# Altium schematic sheet Audio.SchDoc
size A4; Organization: Altium Limited; Address1: L3, 12a Rodborough Rd; Address2: Frenchs Forest; Address3: NSW; Address4: Australia 2086
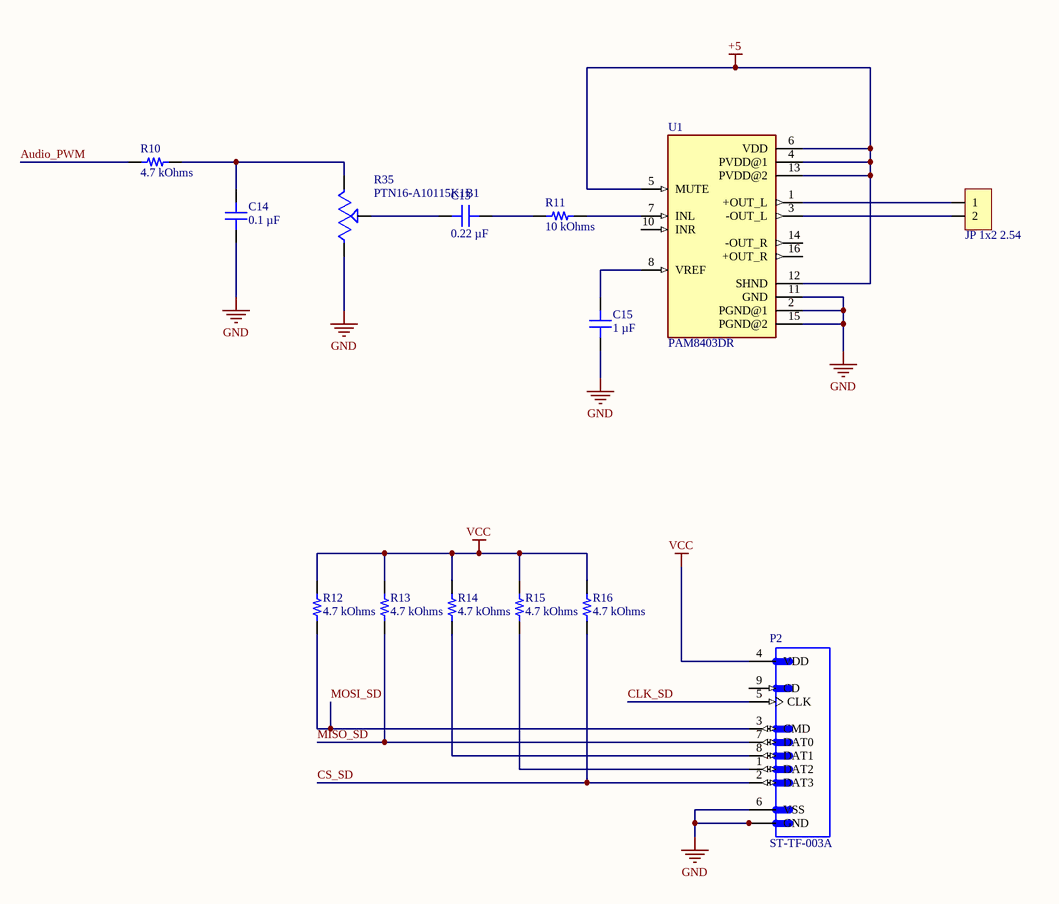
[diagram p0: Audio.SchDoc]

## Parts
C13  0.22 µF  [CAP 0603_1608]
C14  0.1 µF  [CAP 0603_1608]
C15  1 µF  [CAP 0603_1608]
JP5  JP 1x2 2.54  [JP 1x2 CT]
P2  ST-TF-003A  [SUNTECH_ST-TF-003A]
R10  4.7 kOhms  [RES 0603_1608]
R11  10 kOhms  [RES 0603_1608]
R12  4.7 kOhms  [RES 0603_1608]
R13  4.7 kOhms  [RES 0603_1608]
R14  4.7 kOhms  [RES 0603_1608]
R15  4.7 kOhms  [RES 0603_1608]
R16  4.7 kOhms  [RES 0603_1608]
R35  PTN16-A10115K1B1  [POT_PTN16-A10115K1B1]
U1  PAM8403DR  [SOIC127P605X150-16N]

## Nets
+5: U1.4(PVDD@1) U1.5(MUTE) U1.6(VDD) U1.12(SHND) U1.13(PVDD@2)
GND: C14.1 C15.1 P2.6(VSS) P2.G1(GND) P2.G2(GND) P2.G3(GND) P2.G4(GND) R35.1 U1.2(PGND@1) U1.11(GND) U1.15(PGND@2)
VCC: P2.4(VDD) R12.2 R13.2 R14.2 R15.2 R16.2
Audio_PWM: R10.1
CLK_SD: P2.5(CLK)
CS_SD: P2.2(DAT3) R16.1
MISO_SD: P2.7(DAT0) R13.1
MOSI_SD: P2.3(CMD) R12.1
NetC13_1: C13.1 R35.2
NetC13_2: C13.2 R11.1
NetC14_2: C14.2 R10.2 R35.3
NetC15_2: C15.2 U1.8(VREF)
NetJP5_1: JP5.1 U1.1(+OUT_L)
NetJP5_2: JP5.2 U1.3(-OUT_L)
NetP2_1: P2.1(DAT2) R15.1
NetP2_8: P2.8(DAT1) R14.1
NetR11_2: R11.2 U1.7(INL)

Not connected (* = marked no-connect by the designer): P2 9(CD); U1 10(INR) 14(-OUT_R) 16(+OUT_R)

## Notes on the sheet
- Title
- Size:
- Date:
- A4
- Number:
- Time:
- Revision:
- Sheet
- of
- File:

## Library data of the parts
C13 = KGM15BR71A224MT: CAP CER 0.22UF 10V X7R 0603; manufacturer: KYOCERA AVX; Tolerance: ±20%; Part Number: KGM15BR71A224MT; Value: 0.22 µF; Applications: General Purpose; Capacitance: 0.22 µF; componentlink1description: Datasheet; componentlink1url: https://datasheets.kyocera-avx.com/X7RDielectric.pdf; componentlink2description: DigiKey Link; componentlink2url: https://www.digikey.com/en/products/detail/kyocera-avx/KGM15BR71A224MT/1116255; Device Package: 0603 (1608 Metric); lastupdated: 2/9/2024 8:09:12 PM; Lifecycle Status: Active; Minimum Order: 1; Mounting Type: Surface Mount, MLCC; Operating Temperature: -55°C ~ 125°C; Package / Case: 0603 (1608 Metric); packaging: TapeAndReel; partid: 53200; Part Status: Active; price: 0.05; series: KGM - X7R; Size / Dimension: 0.063" L x 0.032" W (1.60mm x 0.81mm); Supplier 1: DigiKey; Supplier Part Number 1: 478-KGM15BR71A224MTCT-ND; Temperature Coefficient: X7R; Thickness (Max): 0.037" (0.95mm); Voltage - Rated: 10V
C14 = CX0603MRX7R6BB104: CAP CER 0.1UF 10V X7R 0603; manufacturer: PulseLarsen Antennas; Tolerance: ±20%; Part Number: CX0603MRX7R6BB104; Value: 0.1 µF; Applications: Bypass, Decoupling; Capacitance: 0.1 µF; componentlink1description: Datasheet; componentlink1url: https://productfinder.pulseelectronics.com/api/open/product-attachments/datasheet/cx0805mrx7r0bb102; componentlink2description: DigiKey Link; componentlink2url: https://www.digikey.com/en/products/detail/pulselarsen-antennas/CX0603MRX7R6BB104/1219074; Device Package: 0603 (1608 Metric); Features: Low ESL (X2Y); lastupdated: 2/9/2024 8:09:55 PM; Lifecycle Status: Active; Minimum Order: 1; Mounting Type: Surface Mount, MLCC; Operating Temperature: -55°C ~ 125°C; Package / Case: 0603 (1608 Metric); packaging: TapeAndReel; partid: 34696; Part Status: Active; price: 0.09; series: X2Y®; Size / Dimension: 0.063" L x 0.033" W (1.60mm x 0.85mm); Supplier 1: DigiKey; Supplier Part Number 1: 311-1237-1-ND; Temperature Coefficient: X7R; Thickness (Max): 0.030" (0.75mm); Voltage - Rated: 10V
C15 = CM105X7R105M10AT: CAP CER 1UF 10V X7R 0603; manufacturer: KYOCERA AVX; Tolerance: ±20%; Part Number: CM105X7R105M10AT; Value: 1 µF; Applications: General Purpose; Capacitance: 1 µF; componentlink1description: Datasheet; componentlink1url: https://ele.kyocera.com/assets/products/capacitor/CM_Series_e.pdf; componentlink2description: DigiKey Link; componentlink2url: https://www.digikey.com/en/products/detail/kyocera-avx/CM105X7R105M10AT/10815023; Device Package: 0603 (1608 Metric); lastupdated: 2/9/2024 8:09:58 PM; Lifecycle Status: Active; Minimum Order: 1; Mounting Type: Surface Mount, MLCC; Operating Temperature: -55°C ~ 125°C; Package / Case: 0603 (1608 Metric); packaging: TapeAndReel; partid: 35538; Part Status: Active; price: 0.02; series: CM; Size / Dimension: 0.063" L x 0.031" W (1.60mm x 0.80mm); Supplier 1: DigiKey; Supplier Part Number 1: 478-CM105X7R105M10ATCT-ND; Temperature Coefficient: X7R; Thickness (Max): 0.035" (0.90mm); Voltage - Rated: 10V
JP5 = JP 1x2 2.54 Cai Thang: Cắm; Ten_Linh_Kien: Jump Đơn Cái 2.54MM 1x20P Thẳng; Don_Vi: Con; Ma_Hang: MH004006; Ghi_Chu: *; Kieu_Chan: *; Chung_Loai: Cắm
P2 = ST-TF-003A: Micro SD Card Socket; Price: None; MP: ST-TF-003A; Availability: Unavailable; Value: *; Package: None
R10 = ERA-3ARB472V: RES SMD 4.7K OHM 0.1% 1/10W 0603; Manufacturer: Panasonic Electronic Components; Power (Watts): 0.1W, 1/10W; Temperature Coefficient: ±10ppm/°C; Part Number: ERA-3ARB472V; Value: 4.7 kOhms; ComponentLink1Description: Datasheet; ComponentLink1URL: https://industrial.panasonic.com/cdbs/www-data/pdf/RDM0000/AOA0000C307.pdf; ComponentLink2Description: DigiKey Link; ComponentLink2URL: https://www.digikey.com/en/products/detail/panasonic-electronic-components/ERA-3ARB472V/3073667; Composition: Thin Film; Device Package: 0603 (1608 Metric); Features: Automotive AEC-Q200; Height - Seated (Max): 0.022" (0.55mm); LastUpdated: 2/9/2024 8:42:34 PM; Lifecycle Status: Active; Minimum Order: 1; Number of Terminations: 2; Operating Temperature: -55°C ~ 155°C; Package / Case: 0603 (1608 Metric); Packaging: TapeAndReel; PartId: 20792; Part Status: Active; Price: 0.15; Ratings: AEC-Q200; Resistance: 4.7 kOhms; Series: ERA-3A; Size / Dimension: 0.063" L x 0.031" W (1.60mm x 0.80mm); Supplier 1: DigiKey; Supplier Part Number 1: P4.7KBDCT-ND; Supplier Device Package: 0603; Tolerance: ±0.1%
R11 = MCT06030E1002BP100: RES SMD 10K OHM 0.1% 1/10W 0603; Manufacturer: Vishay Beyschlag; Power (Watts): 0.1W, 1/10W; Temperature Coefficient: ±15ppm/°C; Part Number: MCT06030E1002BP100; Value: 10 kOhms; ComponentLink1Description: Datasheet; ComponentLink1URL: http://www.vishay.com/docs/28700/mcx0x0xpre.pdf; ComponentLink2Description: DigiKey Link; ComponentLink2URL: http://digikey.com/product-detail/en/vishay-beyschlag/MCT06030E1002BP100/749-1718-1-ND/7348026; Composition: Thin Film; Device Package: 0603 (1608 Metric); Features: Anti-Sulfur; Height - Seated (Max): 0.022" (0.55mm); LastUpdated: 2/9/2024 8:42:57 PM; Lifecycle Status: Active; Minimum Order: 1; Number of Terminations: 2; Operating Temperature: -55°C ~ 125°C; Package / Case: 0603 (1608 Metric); Packaging: TapeAndReel; PartId: 15019; Part Status: Active; Price: 0.26; Resistance: 10 kOhms; Series: MCT - Precision; Size / Dimension: 0.061" L x 0.033" W (1.55mm x 0.85mm); Supplier 1: DigiKey; Supplier Part Number 1: 749-1718-1-ND; Supplier Device Package: 0603; Tolerance: ±0.1%
R12-R16 = URG1608L-472-L-T05: RES SMD 4.7KOHM 0.01% 1/16W 0603; Manufacturer: Susumu; Power (Watts): 0.063W, 1/16W; Temperature Coefficient: ±2ppm/°C; Part Number: URG1608L-472-L-T05; Value: 4.7 kOhms; ComponentLink1Description: Datasheet; ComponentLink1URL: http://www.susumu.co.jp/common/pdf/n_catalog_partition03_en.pdf; ComponentLink2Description: DigiKey Link; ComponentLink2URL: https://www.digikey.com/en/products/detail/susumu/URG1608L-472-L-T05/4552652; Composition: Thin Film; Device Package: 0603 (1608 Metric); Features: Anti-Sulfur, Automotive AEC-Q200; Height - Seated (Max): 0.022" (0.55mm); LastUpdated: 2/9/2024 8:43:04 PM; Lifecycle Status: Active; Minimum Order: 1; Number of Terminations: 2; Operating Temperature: -55°C ~ 155°C; Package / Case: 0603 (1608 Metric); Packaging: TapeAndReel; PartId: 13142; Part Status: Active; Price: 4.24; Ratings: AEC-Q200; Resistance: 4.7 kOhms; Series: URG; Size / Dimension: 0.063" L x 0.031" W (1.60mm x 0.80mm); Supplier 1: DigiKey; Supplier Part Number 1: 408-1772-1-ND; Supplier Device Package: 0603; Tolerance: ±0.01%
R35 = PTN16-A10115K1B1: MF: {'manufacturer': u'CUI Devices'}; Package: None; Price: None; Value: *; MP: PTN16-A10115K1B1; Availability: Unavailable
U1 = PAM8403DR: Amplifier IC 2-Channel _Stereo_ Class D 16-SOP; MF: Diodes Inc.; MP: PAM8403DR; Availability: Unavailable; Package: SOP-16 Diodes Inc.; Value: *; Price: None; SnapEDA_Link: https://www.snapeda.com/parts/PAM8403DR/Diodes%20Inc./view-part/108087/?ref=snap